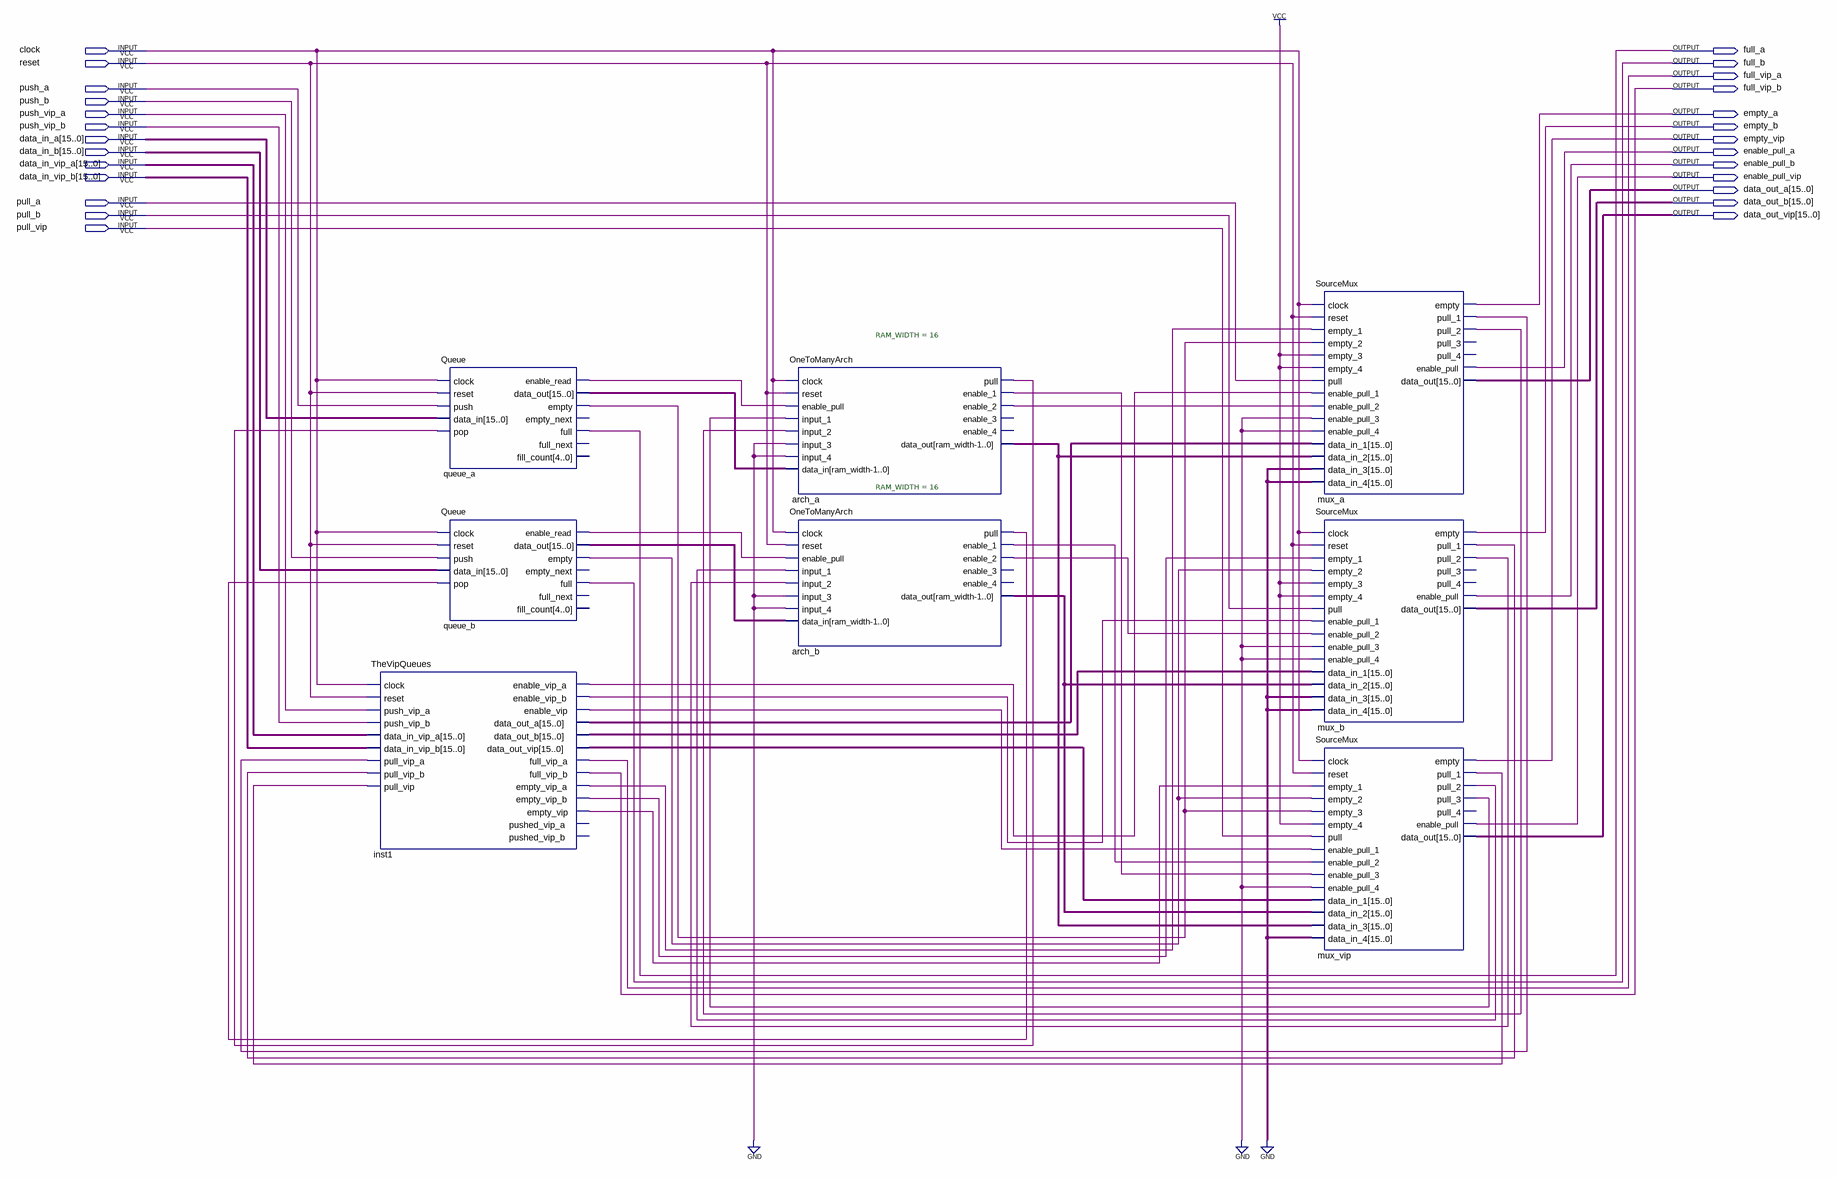
[diagram p0: schematic sheet]
// Quartus schematic TheQueues.bdf as structural Verilog: 8 symbols, 26 pins
module TheQueues (
  input  clock,
  input  reset,
  input  push_a,
  input  push_b,
  input  push_vip_a,
  input  push_vip_b,
  input  [15:0] data_in_a,
  input  [15:0] data_in_b,
  input  [15:0] data_in_vip_a,
  input  [15:0] data_in_vip_b,
  input  pull_a,
  input  pull_b,
  input  pull_vip,
  output full_a,
  output full_b,
  output full_vip_a,
  output full_vip_b,
  output empty_a,
  output empty_b,
  output empty_vip,
  output enable_pull_a,
  output enable_pull_b,
  output enable_pull_vip,
  output [15:0] data_out_a,
  output [15:0] data_out_b,
  output [15:0] data_out_vip
);

  wire arch_a_enable_1, arch_a_enable_2, arch_a_pull, arch_b_enable_1, arch_b_enable_2, arch_b_pull,
       inst1_empty_vip, inst1_empty_vip_a, inst1_empty_vip_b, inst1_enable_vip, inst1_enable_vip_a,
       inst1_enable_vip_b, mux_a_pull_1, mux_a_pull_2, mux_b_pull_1, mux_b_pull_2, mux_vip_pull_1,
       mux_vip_pull_2, mux_vip_pull_3, queue_a_empty, queue_a_enable_read, queue_b_empty, queue_b_enable_read;
  wire [15:0] arch_a_data_out, arch_b_data_out, inst1_data_out_a, inst1_data_out_b, inst1_data_out_vip,
       queue_a_data_out, queue_b_data_out;

  TheVipQueues inst1 (
    .clock(clock), .reset(reset), .push_vip_a(push_vip_a), .push_vip_b(push_vip_b),
    .data_in_vip_a(data_in_vip_a), .data_in_vip_b(data_in_vip_b), .pull_vip_a(mux_a_pull_1),
    .pull_vip_b(mux_b_pull_1), .pull_vip(mux_vip_pull_1), .enable_vip_a(inst1_enable_vip_a),
    .enable_vip_b(inst1_enable_vip_b), .enable_vip(inst1_enable_vip), .data_out_a(inst1_data_out_a),
    .data_out_b(inst1_data_out_b), .data_out_vip(inst1_data_out_vip), .full_vip_a(full_vip_a),
    .full_vip_b(full_vip_b), .empty_vip_a(inst1_empty_vip_a), .empty_vip_b(inst1_empty_vip_b),
    .empty_vip(inst1_empty_vip));  // open: pushed_vip_a, pushed_vip_b
  Queue queue_a (
    .clock(clock), .reset(reset), .push(push_a), .data_in(data_in_a), .pop(arch_a_pull),
    .enable_read(queue_a_enable_read), .data_out(queue_a_data_out), .empty(queue_a_empty), .full(full_a));  // open: empty_next, full_next, fill_count
  Queue queue_b (
    .clock(clock), .reset(reset), .push(push_b), .data_in(data_in_b), .pop(arch_b_pull),
    .enable_read(queue_b_enable_read), .data_out(queue_b_data_out), .empty(queue_b_empty), .full(full_b));  // open: empty_next, full_next, fill_count
  OneToManyArch #(.RAM_WIDTH(16)) arch_a (
    .clock(clock), .reset(reset), .enable_pull(queue_a_enable_read), .input_1(mux_vip_pull_3),
    .input_2(mux_a_pull_2), .input_3(1'b0), .input_4(1'b0), .data_in(queue_a_data_out), .pull(arch_a_pull),
    .enable_1(arch_a_enable_1), .enable_2(arch_a_enable_2), .data_out(arch_a_data_out));  // open: enable_3, enable_4
  OneToManyArch #(.RAM_WIDTH(16)) arch_b (
    .clock(clock), .reset(reset), .enable_pull(queue_b_enable_read), .input_1(mux_vip_pull_2),
    .input_2(mux_b_pull_2), .input_3(1'b0), .input_4(1'b0), .data_in(queue_b_data_out), .pull(arch_b_pull),
    .enable_1(arch_b_enable_1), .enable_2(arch_b_enable_2), .data_out(arch_b_data_out));  // open: enable_3, enable_4
  SourceMux mux_a (
    .clock(clock), .reset(reset), .empty_1(inst1_empty_vip_a), .empty_2(queue_a_empty), .empty_3(1'b1),
    .empty_4(1'b1), .pull(pull_a), .enable_pull_1(inst1_enable_vip_a), .enable_pull_2(arch_a_enable_2),
    .enable_pull_3(1'b0), .enable_pull_4(1'b0), .data_in_1(inst1_data_out_a), .data_in_2(arch_a_data_out),
    .data_in_3({16{1'b0}}), .data_in_4({16{1'b0}}), .empty(empty_a), .pull_1(mux_a_pull_1),
    .pull_2(mux_a_pull_2), .enable_pull(enable_pull_a), .data_out(data_out_a));  // open: pull_3, pull_4
  SourceMux mux_b (
    .clock(clock), .reset(reset), .empty_1(inst1_empty_vip_b), .empty_2(queue_b_empty), .empty_3(1'b1),
    .empty_4(1'b1), .pull(pull_b), .enable_pull_1(inst1_enable_vip_b), .enable_pull_2(arch_b_enable_2),
    .enable_pull_3(1'b0), .enable_pull_4(1'b0), .data_in_1(inst1_data_out_b), .data_in_2(arch_b_data_out),
    .data_in_3({16{1'b0}}), .data_in_4({16{1'b0}}), .empty(empty_b), .pull_1(mux_b_pull_1),
    .pull_2(mux_b_pull_2), .enable_pull(enable_pull_b), .data_out(data_out_b));  // open: pull_3, pull_4
  SourceMux mux_vip (
    .clock(clock), .reset(reset), .empty_1(inst1_empty_vip), .empty_2(queue_b_empty),
    .empty_3(queue_a_empty), .empty_4(1'b1), .pull(pull_vip), .enable_pull_1(inst1_enable_vip),
    .enable_pull_2(arch_b_enable_1), .enable_pull_3(arch_a_enable_1), .enable_pull_4(1'b0),
    .data_in_1(inst1_data_out_vip), .data_in_2(arch_b_data_out), .data_in_3(arch_a_data_out),
    .data_in_4({16{1'b0}}), .empty(empty_vip), .pull_1(mux_vip_pull_1), .pull_2(mux_vip_pull_2),
    .pull_3(mux_vip_pull_3), .enable_pull(enable_pull_vip), .data_out(data_out_vip));  // open: pull_4
endmodule
